# EAGLE design v3pow_2_4v7 (EAGLE 7.7.0)
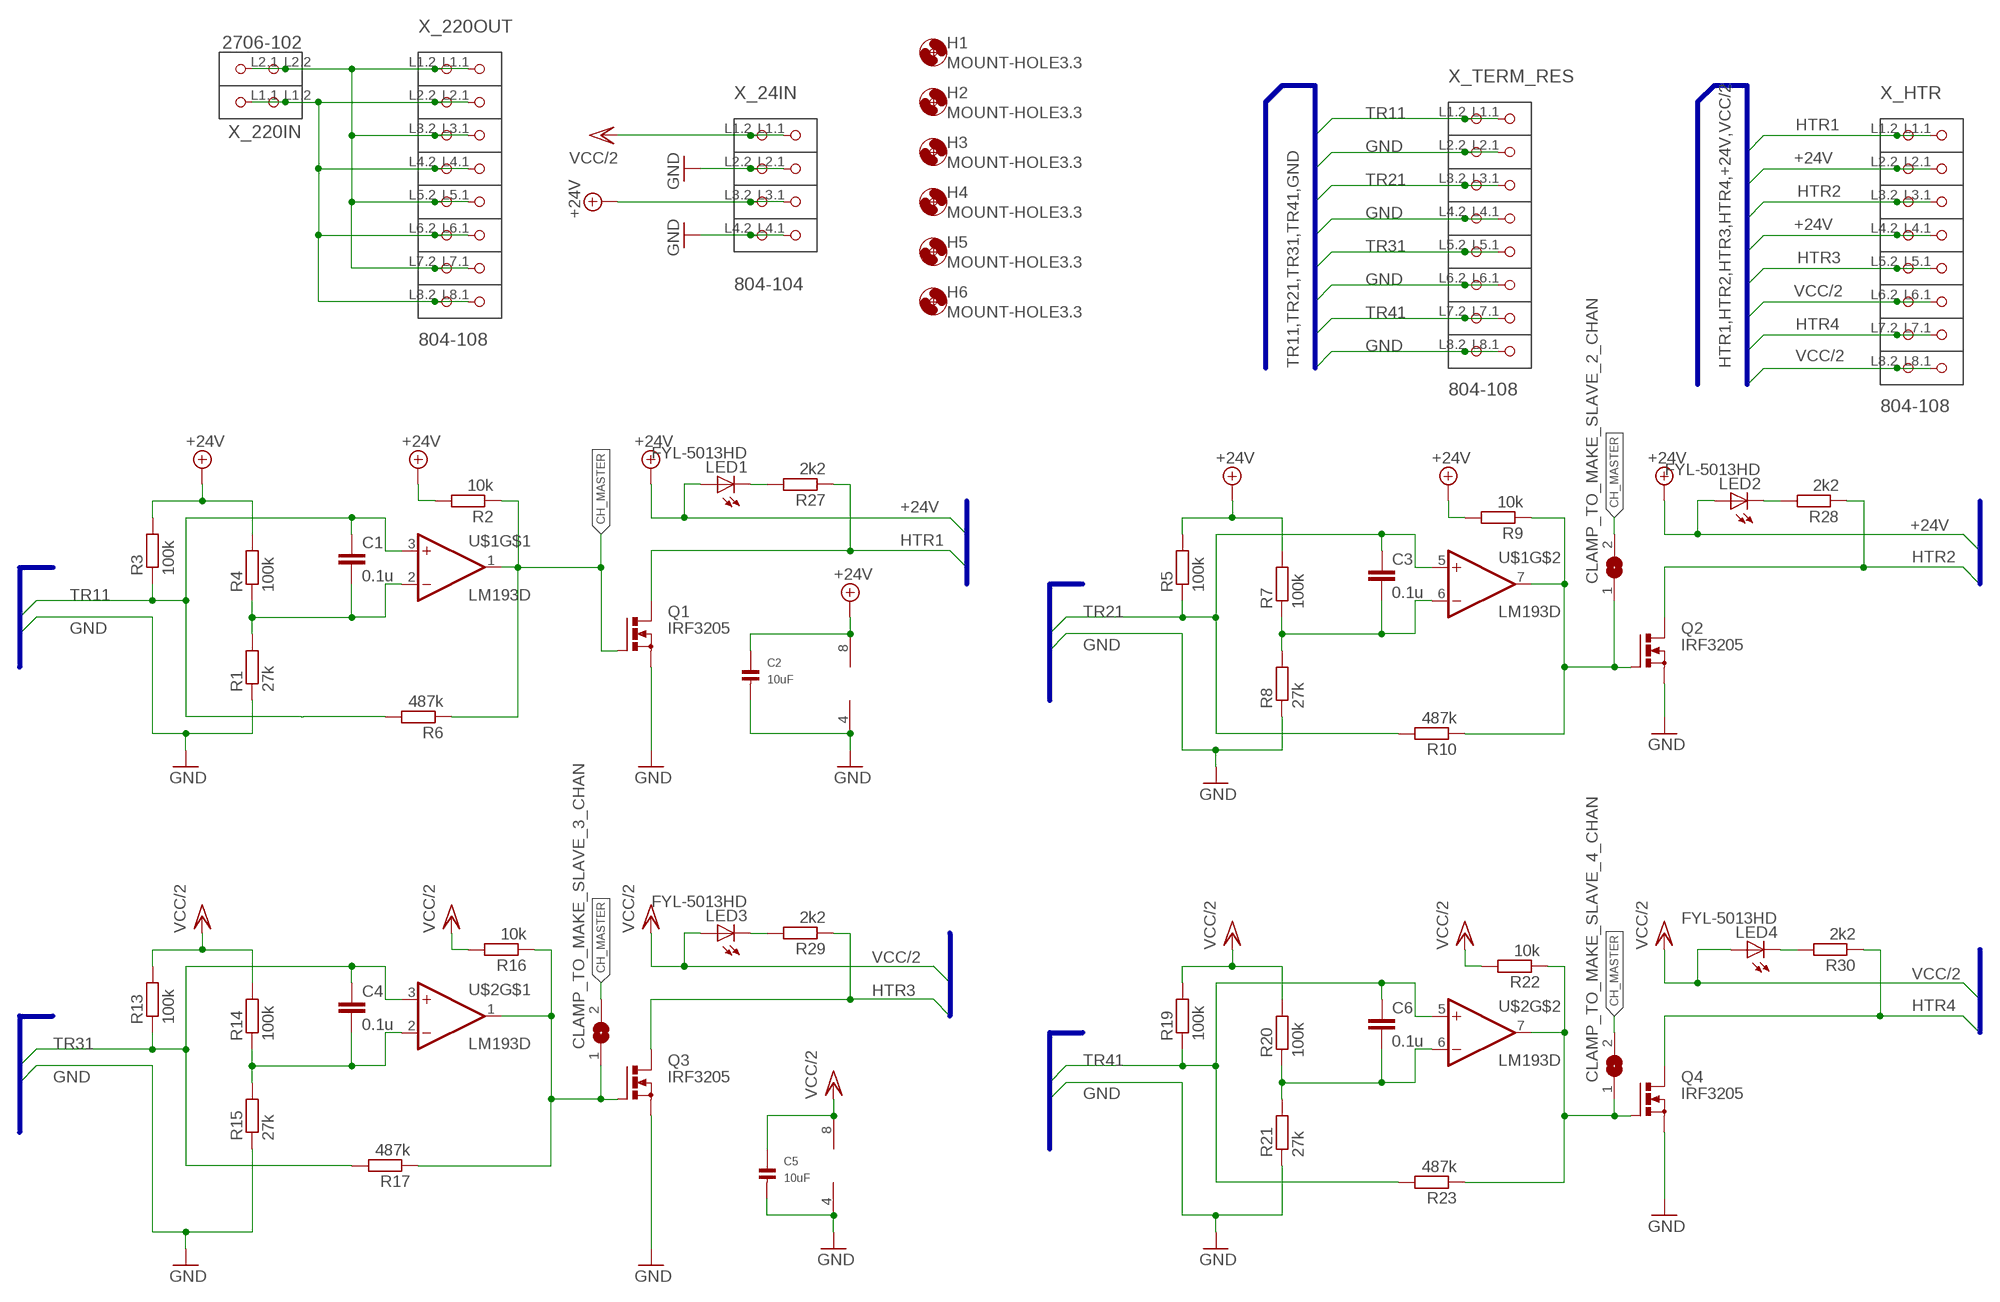
[diagram p0: schematic, sheet 1]

## Parts
C1  0.1u  C-EUC0805  [C0805]
C2  10uF  CAP_CERAMIC1206  [1206]
C3  0.1u  C-EUC0805  [C0805]
C4  0.1u  C-EUC0805  [C0805]
C5  10uF  CAP_CERAMIC1206  [1206]
C6  0.1u  C-EUC0805  [C0805]
CLAMP_TO_MAKE_SLAVE_2_CHAN  SJ  [SJ]
CLAMP_TO_MAKE_SLAVE_3_CHAN  SJ  [SJ]
CLAMP_TO_MAKE_SLAVE_4_CHAN  SJ  [SJ]
H1  MOUNT-HOLE3.3  [3,3]
H2  MOUNT-HOLE3.3  [3,3]
H3  MOUNT-HOLE3.3  [3,3]
H4  MOUNT-HOLE3.3  [3,3]
H5  MOUNT-HOLE3.3  [3,3]
H6  MOUNT-HOLE3.3  [3,3]
LED1  FYL-5013HD  LED5MM  [LED5MM]
LED2  FYL-5013HD  LED5MM  [LED5MM]
LED3  FYL-5013HD  LED5MM  [LED5MM]
LED4  FYL-5013HD  LED5MM  [LED5MM]
Q1  IRF3205  PMOSFET_NTO220BV  [TO220BV]
Q2  IRF3205  PMOSFET_NTO220BV  [TO220BV]
Q3  IRF3205  PMOSFET_NTO220BV  [TO220BV]
Q4  IRF3205  PMOSFET_NTO220BV  [TO220BV]
R1  27k  R-EU_M0805  [M0805]
R2  10k  R-EU_M0805  [M0805]
R3  100k  R-EU_M0805  [M0805]
R4  100k  R-EU_M0805  [M0805]
R5  100k  R-EU_M0805  [M0805]
R6  487k  R-EU_M0805  [M0805]
R7  100k  R-EU_M0805  [M0805]
R8  27k  R-EU_M0805  [M0805]
R9  10k  R-EU_M0805  [M0805]
R10  487k  R-EU_M0805  [M0805]
R13  100k  R-EU_M0805  [M0805]
R14  100k  R-EU_M0805  [M0805]
R15  27k  R-EU_M0805  [M0805]
R16  10k  R-EU_M0805  [M0805]
R17  487k  R-EU_M0805  [M0805]
R19  100k  R-EU_M0805  [M0805]
R20  100k  R-EU_M0805  [M0805]
R21  27k  R-EU_M0805  [M0805]
R22  10k  R-EU_M0805  [M0805]
R23  487k  R-EU_M0805  [M0805]
R27  2k2  R-EU_M0805  [M0805]
R28  2k2  R-EU_M0805  [M0805]
R29  2k2  R-EU_M0805  [M0805]
R30  2k2  R-EU_M0805  [M0805]
U$1  LM193D  [SO08]
U$2  LM193D  [SO08]
X_24IN  804-104  [P-804-104]
X_220IN  2706-102  [P-2706-102]
X_220OUT  804-108  [P-804-108]
X_HTR  804-108  [P-804-108]
X_TERM_RES  804-108  [P-804-108]

## Nets
+24V [24pow]: C2.1 LED1.A LED2.A R2.2 R3.2 R4.2 R5.2 R7.2 R9.2 U$1.8(V+) X_24IN.L3.1(P3.1) X_24IN.L3.2(P3.2) X_HTR.L2.1(P2.1) X_HTR.L2.2(P2.2) X_HTR.L4.1(P4.1) X_HTR.L4.2(P4.2)
CH_MASTER: CLAMP_TO_MAKE_SLAVE_2_CHAN.2 CLAMP_TO_MAKE_SLAVE_3_CHAN.2 CLAMP_TO_MAKE_SLAVE_4_CHAN.2 Q1.G R2.1 R6.1 U$1.1(OUT)
GND [24pow]: C2.2 C5.2 Q1.S Q2.S Q3.S Q4.S R1.1 R8.1 R15.1 R21.1 U$1.4(V-) U$2.4(V-) X_24IN.L2.1(P2.1) X_24IN.L2.2(P2.2) X_24IN.L4.1(P4.1) X_24IN.L4.2(P4.2) X_TERM_RES.L2.1(P2.1) X_TERM_RES.L2.2(P2.2) X_TERM_RES.L4.1(P4.1) X_TERM_RES.L4.2(P4.2) X_TERM_RES.L6.1(P6.1) X_TERM_RES.L6.2(P6.2) X_TERM_RES.L8.1(P8.1) X_TERM_RES.L8.2(P8.2)
HTR1 [mosfet_pow]: Q1.D R27.1 X_HTR.L1.1(P1.1) X_HTR.L1.2(P1.2)
HTR2 [mosfet_pow]: Q2.D R28.1 X_HTR.L3.1(P3.1) X_HTR.L3.2(P3.2)
HTR3 [mosfet_pow]: Q3.D R29.1 X_HTR.L5.1(P5.1) X_HTR.L5.2(P5.2)
HTR4 [mosfet_pow]: Q4.D R30.1 X_HTR.L7.1(P7.1) X_HTR.L7.2(P7.2)
N44 [f220]: X_220IN.L2.1(P2.1) X_220IN.L2.2(P2.2) X_220OUT.L1.1(P1.1) X_220OUT.L1.2(P1.2) X_220OUT.L3.1(P3.1) X_220OUT.L3.2(P3.2) X_220OUT.L5.1(P5.1) X_220OUT.L5.2(P5.2) X_220OUT.L7.1(P7.1) X_220OUT.L7.2(P7.2)
N$1: CLAMP_TO_MAKE_SLAVE_3_CHAN.1 Q3.G R16.1 R17.1 U$2.1(OUT)
N$2: CLAMP_TO_MAKE_SLAVE_2_CHAN.1 Q2.G R9.1 R10.1 U$1.7(OUT)
N$3: CLAMP_TO_MAKE_SLAVE_4_CHAN.1 Q4.G R22.1 R23.1 U$2.7(OUT)
N$10: C3.2 R7.1 R8.2 U$1.6(-IN)
N$13: C1.2 R1.2 R4.1 U$1.2(-IN)
N$15: C4.2 R14.1 R15.2 U$2.2(-IN)
N$20: C6.2 R20.1 R21.2 U$2.6(-IN)
N$28: LED1.K(C) R27.2
N$31: LED2.K(C) R28.2
N$34: LED3.K(C) R29.2
N$36: LED4.K(C) R30.2
NN55 [f220]: X_220IN.L1.1(P1.1) X_220IN.L1.2(P1.2) X_220OUT.L2.1(P2.1) X_220OUT.L2.2(P2.2) X_220OUT.L4.1(P4.1) X_220OUT.L4.2(P4.2) X_220OUT.L6.1(P6.1) X_220OUT.L6.2(P6.2) X_220OUT.L8.1(P8.1) X_220OUT.L8.2(P8.2)
TR11: C1.1 R3.1 R6.2 U$1.3(+IN) X_TERM_RES.L1.1(P1.1) X_TERM_RES.L1.2(P1.2)
TR21: C3.1 R5.1 R10.2 U$1.5(+IN) X_TERM_RES.L3.1(P3.1) X_TERM_RES.L3.2(P3.2)
TR31: C4.1 R13.1 R17.2 U$2.3(+IN) X_TERM_RES.L5.1(P5.1) X_TERM_RES.L5.2(P5.2)
TR41: C6.1 R19.1 R23.2 U$2.5(+IN) X_TERM_RES.L7.1(P7.1) X_TERM_RES.L7.2(P7.2)
VCC/2: C5.1 LED3.A LED4.A R13.2 R14.2 R16.2 R19.2 R20.2 R22.2 U$2.8(V+) X_24IN.L1.1(P1.1) X_24IN.L1.2(P1.2) X_HTR.L6.1(P6.1) X_HTR.L6.2(P6.2) X_HTR.L8.1(P8.1) X_HTR.L8.2(P8.2)

## Buses
TR11,TR12,TR21,TR22,TR31,TR32,TR41,TR42,GND
HTR1,HTR2,HTR3,HTR4,+24V,VCC/2
TR11,TR21,TR31,TR41,GND

## Library data of the parts
C1 C3 C4 C6 = rcl:C-EU: CAPACITOR, European symbol
C2 C5 = microbuilder:CAP_CERAMIC: Ceramic Capacitors 0402 - 0402 Surface Mount Capacitors 16pF 50V 5% [Digikey: 445-4899-2-ND] 18pF 50V 5% [Digikey: 490-1281-2-ND] 22pF 50V 5% [Digikey: 490-1283-2-ND] 68pF 50V 5% [Digikey: 490-1289-2-ND] 0.1uF 10V 10% [Digikey: 490-1318-2-ND] 1.0uF 6.3V 10% [Digikey: 490-1320-2-ND] 0603 - 0603 Surface Mount Capacitors 16 pF 50V 5% [Digikey: 445-5051-2-ND] 22 pF 50V [Digikey: PCC220ACVTR-ND] 33 pF 50V 5% [Digikey: 490-1415-1-ND] 56pF 50V 5% [Digikey: 490-1421-1-ND] 220pF 50V 5% [Digikey: 445-1285-1-ND] 680 pF 50V 2200 pF 50V 5% C0G [Digikey: 445-1297-1-ND] 5600 pF 100V 5% X7R [Digikey: 478-3711-1-ND] 0.1 µF 25V 10% [Digikey: PCC2277TR-ND] 0.22 µF 16V 10% X7R [Digikey: 445-1318-1-ND] 1.0 µF 25V 10% [Digikey: 445-5146-2-ND] 0603 - RF Specific 3pF 250V +/-0.1pF RF [Digikey: 712-1347-1-ND] 18 pF 250V 5% [Digikey: 478-3505-1-ND or 712-1322-1-ND] 56 pF 250V 5% C0G RF [Digikey: 490-4867-1-ND] 68 pF 250V RF [Digikey: 490-4868-1-ND] 0805 - 0805 Surface Mount Capacitors 220 pF 250V 2% RF Ceramic Capacitor [Digikey: 712-1398-1-ND] 1000 pF 50V 2% NP0 Ceramic Capacitor [Digikey: 478-3760-1-ND] 0.1 µF 25V 10% Ceramic Capacitor [Digikey: PCC1828TR-ND] 1.0 µF 16V 10% Ceramic Capacitor[Digikey: 490-1691-2-ND] 10.0 µF 10V 10% Ceramic Capacitor[Digikey: 709-1228-1-ND] 10.0 uF 16V 10% Ceramic Capacitor [Digikey: 478-5165-2-ND] 47 uF 6.3V 20% Ceramic Capacitor [Digikey: 587-1779-1-ND or 399-5506-1-ND] 1206 - 1206 Surface Mount Capacitors 47uF 10V 20% Ceramic Capacitor [Digikey: 490-5528-1-ND or 399-5508-1-ND or 445-6010-1-ND] 100uF 6.3V -20%, +80% Y5V Ceramic Capacitor (Digikey: 490-4512-1-ND, Mouser: 81-GRM31CF50J107ZE1L)
CLAMP_TO_MAKE_SLAVE_2_CHAN CLAMP_TO_MAKE_SLAVE_3_CHAN CLAMP_TO_MAKE_SLAVE_4_CHAN = jumper:SJ: SMD solder JUMPER
H1-H6 = holes:MOUNT-HOLE: MOUNTING HOLE with drill center marker
LED1-LED4 = adafruit:LED: LED OSRAM: - CHIPLED LG R971, LG N971, LY N971, LG Q971, LY Q971, LO R971, LY R971 LH N974, LH R974 LS Q976, LO Q976, LY Q976 LO Q996 - Hyper CHIPLED LW Q18S LB Q993, LB Q99A, LB R99A - SideLED LS A670, LO A670, LY A670, LG A670, LP A670 LB A673, LV A673, LT A673, LW A673 LH A674 LY A675 LS A676, LA A676, LO A676, LY A676, LW A676 LS A679, LY A679, LG A679 - Hyper Micro SIDELED® LS Y876, LA Y876, LO Y876, LY Y876 LT Y87S - SmartLED LW L88C, LW L88S LB L89C, LB L89S, LG L890 LS L89K, LO L89K, LY L89K LS L896, LA L896, LO L896, LY L896 - TOPLED LS T670, LO T670, LY T670, LG T670, LP T670 LSG T670, LSP T670, LSY T670, LOP T670, LYG T670 LG T671, LOG T671, LSG T671 LB T673, LV T673, LT T673, LW T673 LH T674 LS T676, LA T676, LO T676, LY T676, LB T676, LH T676, LSB T676, LW T676 LB T67C, LV T67C, LT T67C, LS T67K, LO T67K, LY T67K, LW E67C LS E67B, LA E67B, LO E67B, LY E67B, LB E67C, LV E67C, LT E67C LW T67C LS T679, LY T679, LG T679 LS T770, LO T770, LY T770, LG T770, LP T770 LB T773, LV T773, LT T773, LW T773 LH T774 LS E675, LA E675, LY E675, LS T675 LS T776, LA T776, LO T776, LY T776, LB T776 LHGB T686 LT T68C, LB T68C - Hyper Mini TOPLED® LB M676 - Mini TOPLED Santana® LG M470 LS M47K, LO M47K, LY M47K Source: http://www.osram.convergy.de/
Q1-Q4 = transistor-power:PMOSFET_N: Power MOSFET N-Channel
R1-R10 R13-R17 R19-R23 R27-R30 = rcl:R-EU_: RESISTOR, European symbol
U$1 U$2 = linear:LM193: lm193 LM193
X_24IN = con-wago_804:804-104: Serie 804, 1-Leiter-Klemmenleiste für Leiterplatten 2 Lötstifte/Pol versetzt / Series 804, 1-conductor PCB terminal strip 2 solder pins/pole, staggered Polzahl / Pole No.: 4 Rastermaß / Pitch: 5 - 5 mm Bemessungsspannung / Rated Voltage: 320 V Nennstrom / Nominal Current: 24 A Leiterquerschnitt / Conductor Size: 0.25 - 2.5 mm2 Anschlusstechnik / Connection Technology: CAGE CLAMP® S Lötstiftlänge: / Solder Pin Length: 3.6 mm Leitereinführung (zur Platine) / Conductor entry angle (to PCB): 0 ° Farbe / Color: grau / gray Stand: 01.01.2014. Die jeweils aktuellen Daten zu diesem Artikel finden Sie in unserem Produktkatalog, den Sie unter www.wago.com einsehen können. As of: 01/01/2014. Please find the newest data for this article in our product catalogue, which can be viewed under www.wago.com.
X_220IN = con-wago_2706:2706-102: Serie 2706, Klemmenleisten mit Betätigungshebeln 2 Lötstifte/Pol / Series 2706, Terminal strips with operating levers 2 solder pins/pole Polzahl / Pole No.: 2 Rastermaß / Pitch: 7.5 mm Bemessungsspannung / Rated Voltage: 630 V Nennstrom / Nominal Current: 41 A Leiterquerschnitt / Conductor Size: 0.5 - 6 mm2 Anschlusstechnik / Connection Technology: CAGE CLAMP® Lötstiftlänge: / Solder Pin Length: 4.5 mm Leitereinführung (zur Platine) / Conductor entry angle (to PCB): 30 ° Farbe / Color: grau / gray Stand: 01.01.2014. Die jeweils aktuellen Daten zu diesem Artikel finden Sie in unserem Produktkatalog, den Sie unter www.wago.com einsehen können. As of: 01/01/2014. Please find the newest data for this article in our product catalogue, which can be viewed under www.wago.com.
X_220OUT X_HTR X_TERM_RES = con-wago_804:804-108: Serie 804, 1-Leiter-Klemmenleiste für Leiterplatten 2 Lötstifte/Pol versetzt / Series 804, 1-conductor PCB terminal strip 2 solder pins/pole, staggered Polzahl / Pole No.: 8 Rastermaß / Pitch: 5 - 5 mm Bemessungsspannung / Rated Voltage: 320 V Nennstrom / Nominal Current: 24 A Leiterquerschnitt / Conductor Size: 0.25 - 2.5 mm2 Anschlusstechnik / Connection Technology: CAGE CLAMP® S Lötstiftlänge: / Solder Pin Length: 3.6 mm Leitereinführung (zur Platine) / Conductor entry angle (to PCB): 0 ° Farbe / Color: grau / gray Stand: 01.01.2014. Die jeweils aktuellen Daten zu diesem Artikel finden Sie in unserem Produktkatalog, den Sie unter www.wago.com einsehen können. As of: 01/01/2014. Please find the newest data for this article in our product catalogue, which can be viewed under www.wago.com.

## Net classes
0 default: width 0.508 mm
1 f220: width 1.524 mm, clearance 1.27 mm
2 24pow: width 1.016 mm
3 mosfet_pow: width 1.524 mm

## Board
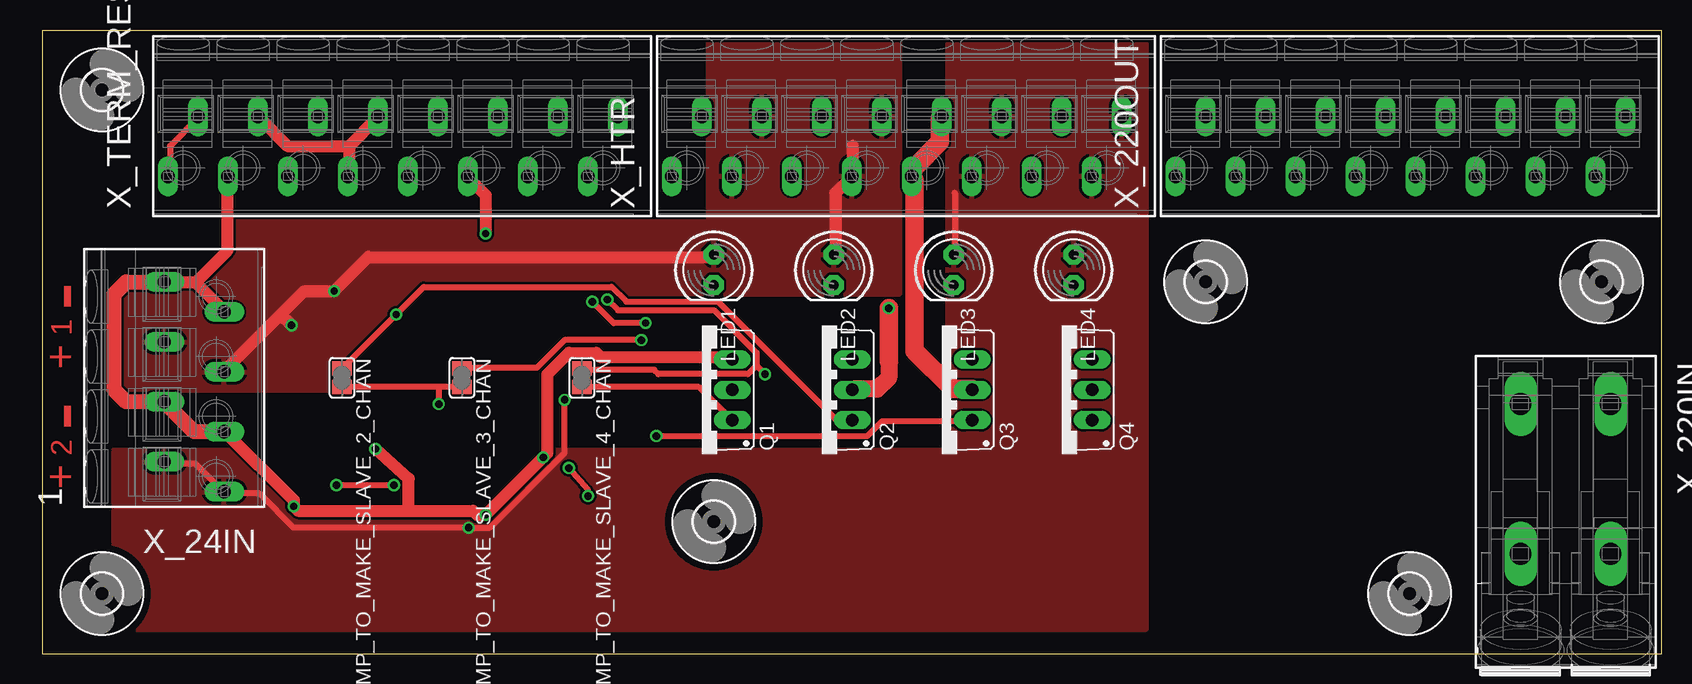
[diagram p1: board, top side]
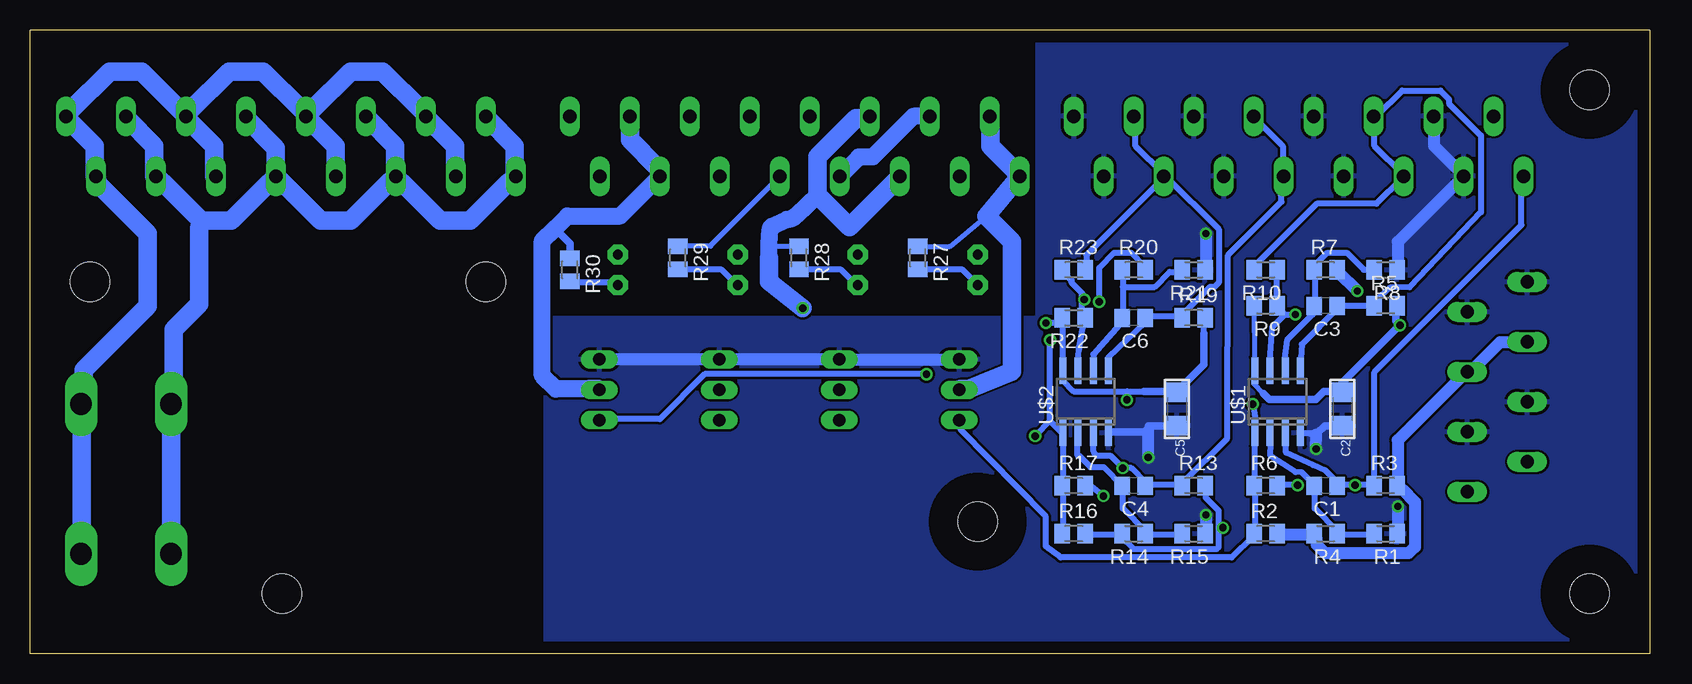
[diagram p2: board, bottom side, seen from below]

Size 135 x 52 mm. Coordinates in mm from the lower left corner, seen from the top.
Outline: 0,0 135,0 135,52 0,52 0,0
Copper layers (1*16): Top 0.035mm / dielectric 1.5mm / Bottom 0.035mm
Design rules "default": minimum track width 10mil, minimum drill 24mil, track to track 8mil, track to pad 8mil, pad to pad 8mil, via to via 8mil, smd to smd 8mil, copper to edge 40mil, drill to drill 8mil, minimum pad ring 10mil, minimum via ring 8mil, stop-mask expansion 4mil, vias tented up to drill 0mil, thermal gap 10mil
tRestrict: area 92.5,-4 to 138,57

### Footprints (pad centres in the part's own frame; a part is rotated, then mirrored left to right if it is on the bottom)
C0805 = smd 1.3 x 1.5: 1 -0.95,0; 2 0.95,0
1206 = smd 1.6 x 1.8: 1 -1.4,0; 2 1.4,0
SJ = smd 1.168 x 1.6: 1 -0.762,0; 2 0.762,0
3,3 = hole 3.3: 0,0
LED5MM = drill 0.813 pad 1.676 octagon: A -1.27,0; K 1.27,0
TO220BV = drill 1.016 long: D 0,-2.54; G -2.54,-2.54; S 2.54,-2.54
M0805 = smd 1.3 x 1.6: 1 -0.95,0; 2 0.95,0
SO08 = smd 0.6 x 2.2: 1 -1.905,-2.6; 2 -0.635,-2.6; 3 0.635,-2.6; 4 1.905,-2.6; 5 1.905,2.6; 6 0.635,2.6; 7 -0.635,2.6; 8 -1.905,2.6
P-804-104 = drill 1.1 long: L1.1 0.8,7; L1.2 -4.2,9.5; L2.1 0.8,2; L2.2 -4.2,4.5; L3.1 0.8,-3; L3.2 -4.2,-0.5; L4.1 0.8,-8; L4.2 -4.2,-5.5
P-2706-102 = drill 1.8 long: L1.1 3.185,3.75; L1.2 -9.315,3.75; L2.1 3.185,-3.75; L2.2 -9.315,-3.75
P-804-108 = drill 1.1 long: L1.1 0.8,17; L1.2 -4.2,19.5; L2.1 0.8,12; L2.2 -4.2,14.5; L3.1 0.8,7; L3.2 -4.2,9.5; L4.1 0.8,2; L4.2 -4.2,4.5; L5.1 0.8,-3; L5.2 -4.2,-0.5; L6.1 0.8,-8; L6.2 -4.2,-5.5; L7.1 0.8,-13; L7.2 -4.2,-10.5; L8.1 0.8,-18; L8.2 -4.2,-15.5

### Placement (x,y rotation side)
C1  27,14 180 bottom
C2  25.6,20.4 270 bottom
C3  27,29 180 bottom
C4  43,14 180 bottom
C5  39.4,20.4 270 bottom
C6  43,28 180 bottom
CLAMP_TO_MAKE_SLAVE_2_CHAN  25,23 270 top
CLAMP_TO_MAKE_SLAVE_3_CHAN  35,23 270 top
CLAMP_TO_MAKE_SLAVE_4_CHAN  45,23 270 top
H1  5,47 0 top
H2  5,5 0 top
H3  114,5 0 top
H4  56,11 0 top
H5  130,31 0 top
H6  97,31 0 top
LED1  56,32 270 top
LED2  66,32 270 top
LED3  76,32 270 top
LED4  86,32 270 top
Q1  55,22 90 top
Q2  65,22 90 top
Q3  75,22 90 top
Q4  85,22 90 top
R1  22,10 180 bottom
R2  32,10 0 bottom
R3  22,14 0 bottom
R4  27,10 180 bottom
R5  22,29 0 bottom
R6  32,14 0 bottom
R7  27,32 0 bottom
R8  22,32 180 bottom
R9  32,29 180 bottom
R10  32,32 180 bottom
R13  38,14 0 bottom
R14  43,10 180 bottom
R15  38,10 180 bottom
R16  48,10 0 bottom
R17  48,14 0 bottom
R19  38,28 0 bottom
R20  43,32 0 bottom
R21  38,32 180 bottom
R22  48,28 180 bottom
R23  48,32 0 bottom
R27  61,33 270 bottom
R28  70.9,33 270 bottom
R29  81,33 270 bottom
R30  90,32 270 bottom
U$1  31,21 0 bottom
U$2  47,21 0 bottom
X_24IN  11,23 180 top
X_220IN  127,11.5 270 top
X_220OUT  114,44 90 top
X_HTR  72,44 90 top
X_TERM_RES  30,44 90 top

### Tracks (layer width: path | path; a pad name or v marks a point on that pad's centre or on a via)
+24V  (via drill 0.61)
  Top 1.016: 67.56,42.32 67.56,39.83 X_HTR.L4.2 67.21,39.47 66.14,38.41 66.14,33.43 LED2.A | 19.91,28.27 15.29,23.65 X_24IN.L3.2 | 19.91,28.27 21.87,30.23 v24.36,30.23 27.2,33.07 55.65,33.07 LED1.A | 19.91,28.27 v20.8,27.38
  Bottom 0.406: 32.18,21.69 33,22.51 33,23 32.91,23.09 U$1.8 32.9,26.8 32.95,26.85 R9.2
  Bottom 0.61: 26.14,21.87 27.13,21.87 27.8,21.2 31.69,21.2 32.18,21.69 | C2.1 25.6,22.58 v20.8,27.38 21.16,27.74 21.16,28.98
  Bottom 1.016: 21.16,28.98 R5.2 | 32.89,28.98 R9.2 | R2.2 30.94,9.96 28.09,9.96 R4.2 27.74,9.6 27.74,9.07 27.03,8.36 20.09,8.36 19.56,8.89 19.56,12.62 20.62,13.69 R3.2 20.98,14.05 20.98,17.78 15.29,23.47 X_24IN.L3.2 14.76,23.65 12.45,25.96 10.31,25.96 X_24IN.L3.1 | v24.36,30.23 25.96,31.83 R7.2 | 26.14,21.87 25.78,21.87 C2.1
  Bottom 1.422: X_HTR.L2.1 61.37,44.8 64.77,41.4 65.9,41.4 X_HTR.L4.2
  pour Top: 6,36 6,22 53,22 53,30 71.5,30 71.5,51 55.5,51 55.5,36
CH_MASTER  (via drill 0.61)
  Top 0.508: CLAMP_TO_MAKE_SLAVE_4_CHAN.2 45.16,22.23 54.76,22.23 57.43,19.56 Q1.G | 33.07,22.23 34.85,22.23 CLAMP_TO_MAKE_SLAVE_3_CHAN.2 | 33.07,22.23 25.07,22.23 CLAMP_TO_MAKE_SLAVE_2_CHAN.2 | 33.07,22.23 v33.07,20.8
  Bottom 0.508: v33.07,20.8 32.87,19.49 U$1.1 32.89,18.31 32.89,14.22 R6.1 32.89,13.87 32.89,10.13 R2.1 33.07,9.78 34.85,8 49.07,8 50.32,8.94 50.32,11.43 57.43,18.67 57.43,19.38 Q1.G
GND  (via drill 0.61)
  Top 1.016: 25.6,42.32 25.6,39.83 X_TERM_RES.L4.2 | 25.6,42.32 27.91,44.63 X_TERM_RES.L4.1 | 25.6,42.32 20.45,42.32 18.14,44.63 X_TERM_RES.L2.1 | v36.98,35.03 36.98,38.23 35.56,39.65 X_TERM_RES.L6.2 | 12.8,30.94 10.31,30.94 X_24IN.L4.1 | 12.8,30.94 15.11,28.63 X_24IN.L4.2 | X_24IN.L2.2 15.29,18.49 20.98,12.8 v20.98,12.27 21.34,11.91 30.58,11.91 | 30.58,11.91 35.92,11.91 36.27,11.56 v36.98,11.56 v41.78,16.36 42.14,16.71 42.14,23.29 43.92,25.07 46.23,25.07 46.58,24.71 57.43,24.71 Q1.S | v27.79,17.07 30.58,14.58 30.58,11.91 | 12.8,30.94 15.47,33.6 15.47,39.65 X_TERM_RES.L2.2
  Top 1.27: X_24IN.L2.2 12.7,18.5 X_24IN.L2.1 7,21 6,22 6,30 7,31 X_24IN.L4.1
  Bottom 0.406: 27.68,18.39 28.09,18.4 U$1.4 29.05,18.36 27.78,18.26 | U$2.4 44.99,18.5
  Bottom 0.61: C5.2 41.78,19 | C2.2 27.07,19 27.68,18.39 | 44.99,18.5 41.83,18.5 41.78,18.54
  Bottom 1.016: R8.1 20.98,32 20.98,34.31 15.65,39.65 X_TERM_RES.L2.2 15.82,40.18 17.96,42.32 17.96,44.63 X_TERM_RES.L2.1 | v36.98,35.03 36.98,32 R21.1 | Q1.S 57.61,24.54 67.39,24.54 Q2.S 67.92,24.54 77.52,24.54 Q3.S 78.05,24.54 87.48,24.54 Q4.S | v20.98,12.27 20.98,10.13 R1.1 | v36.98,11.56 36.98,10.13 R15.1 | v27.79,17.07 27.78,18.26 | v41.78,16.36 41.78,18.54
  pour Bottom: 1,51 1,1 92,1 92,28 51,28 51,51
HTR1
  Bottom 0.406: R27.1 58.33,33.95 55.28,36.49
  Bottom 1.524: Q1.D 57.43,22.05 56.72,22.05 53.15,23.51 53.15,34.36 55.28,36.49 52.63,39.65 X_HTR.L1.2 52.98,40.36 54.94,42.32 54.94,44.63 X_HTR.L1.1
HTR2  (via drill 0.61)
  Top 1.422: 70.59,24.36 70.59,23.01 69.62,22.05 67.59,22.05 Q2.D
  Top 1.524: v70.59,28.8 70.59,24.36
  Bottom 0.406: R28.1 72.85,33.95 73.4,34.2
  Bottom 1.422: 73.4,32.97 73.4,34.2 73.3,35.33 arc45 73.18,35.62 71.9,36.2 arc-45 71.16,36.51 69.34,38.23
  Bottom 1.524: X_HTR.L3.2 62.59,39.65 66.67,35.56 69.34,38.23 69.34,41.43 66.14,44.63 65.08,44.63 X_HTR.L3.1 | v70.59,28.8 73.4,31.02 73.4,32.97
HTR3
  Top 1.524: Q3.D 77.52,22.05 75.92,22.05 72.72,25.25 72.72,39.47 72.54,39.65 X_HTR.L5.2 72.72,40.54 74.85,42.67 74.85,44.63 X_HTR.L5.1
  Bottom 0.406: R29.1 78.23,33.96 78.23,34.07 X_HTR.L5.2
  Bottom 1.524: 72.54,39.65 X_HTR.L5.2
HTR4
  Bottom 0.61: R30.1 90,34.2 91.25,35.45
  Bottom 1.422: 88.37,22.05 91.15,22.05 92.3,23.2 92.3,34.4 91.25,35.45 90.2,36.5 85.8,36.5 X_HTR.L7.2
  Bottom 1.524: X_HTR.L7.1 84.99,44.63 84.99,42.85 82.68,40.54 X_HTR.L7.2 | 88.37,22.05 87.66,22.05 Q4.D
N44
  Bottom 1.524: X_220OUT.L1.1 96.9,44.63 94.59,42.32 94.59,39.83 X_220OUT.L1.2 95.12,39.29 98.32,36.09 100.81,36.09 104.01,39.29 X_220OUT.L3.2 | X_220OUT.L3.2 104.55,39.83 104.55,42.32 106.86,44.63 X_220OUT.L3.1 | X_220IN.L2.1 123.22,8.36 123.22,20.8 X_220IN.L2.2 123.04,21.51 123.04,27.03 120.9,29.16 120.9,35.38 120.73,36.09 | X_220OUT.L5.2 114.5,39.83 114.5,42.14 116.99,44.63 X_220OUT.L5.1 | X_220OUT.L7.1 126.95,44.63 124.64,42.32 124.64,39.83 X_220OUT.L7.2 123.93,39.29 120.73,36.09 | 120.73,36.09 118.24,36.09 115.04,39.29 X_220OUT.L5.2 | X_220OUT.L3.2 105.08,39.29 108.28,36.09 110.77,36.09 113.97,39.29 X_220OUT.L5.2
N$1  (via drill 0.61)
  Top 0.508: v49.96,26.14 43.56,26.14 41.25,23.82 35.03,23.82 CLAMP_TO_MAKE_SLAVE_3_CHAN.1 | v51.21,18.14 68.81,18.14 70.05,19.38 77.52,19.38 Q3.G
  Bottom 0.508: R16.1 48.9,10.13 48.9,13.87 R17.1 48.9,14.22 48.9,18.31 U$2.1 49.07,18.49 49.96,19.38 | 49.96,19.38 v49.96,26.14 | 49.96,19.38 v51.21,18.14
N$2  (via drill 0.61)
  Top 0.508: CLAMP_TO_MAKE_SLAVE_2_CHAN.1 25.07,23.82 v29.52,28.27 31.83,30.58 47.47,30.58 48.72,29.34 56.36,29.34 66.14,19.56 67.39,19.56 Q2.G
  Bottom 0.508: R10.1 31.11,31.83 31.11,29.16 R9.1 30.94,28.8 30.4,28.27 | 30.4,28.27 v29.52,28.27 | 30.4,28.27 31.47,27.2 31.67,24.45 U$1.7
N$3  (via drill 0.61)
  Top 0.508: 59.56,24 58.85,23.29 51.38,23.29 51.03,23.65 45.16,23.65 CLAMP_TO_MAKE_SLAVE_4_CHAN.1 | 59.56,24 59.56,25.07 56.01,28.63 48.01,28.63 v47.12,29.52 | 59.56,24 v60.27,23.29
  Bottom 0.508: U$2.7 47.67,23.95 47.62,24.84 47.55,25.38 47.12,27.91 R22.1 47.3,28.09 47.3,29.52 | 47.3,29.52 47.3,30.05 48.18,30.94 48.18,31.11 48.9,31.83 R23.1 | v47.12,29.52 47.3,29.52 | v60.27,23.29 78.77,23.29 82.5,19.56 87.48,19.56 Q4.G
N$10
  Bottom 0.508: R8.2 23.11,32 23.82,32 25.25,33.43 26.85,33.43 28.09,32.18 R7.1 27.91,31.83 27.91,29.16 C3.2 28.09,28.8 28.09,28.27 30.23,26.14 30.43,24.55 U$1.6
N$13
  Bottom 0.508: R1.2 23.11,9.96 25.78,9.96 R4.1 25.96,10.13 27.91,12.09 27.91,13.87 C1.2 28.09,14.22 28.98,15.11 29.52,15.14 31.6,16.46 31.57,17.51 U$1.2
N$15
  Bottom 0.508: C4.2 43.92,13.87 43.92,12.09 41.96,10.13 R14.1 41.78,9.96 39.12,9.96 R15.2 | U$2.2 47.67,17.61 47.68,16.51 47.57,16.51 46.61,15.54 45.49,15.54 C4.2 | 44.09,14.22 C4.2
N$20
  Bottom 0.508: 43.92,30.58 43.92,31.83 R20.1 | 43.92,30.58 43.92,28.09 C6.2 43.92,27.74 46.35,24.94 46.35,23.72 U$2.6 | 43.92,30.58 41.25,30.58 40.01,31.83 39.12,31.83 R21.2
N$28
  Bottom 0.508: R27.2 60.98,32 57.25,32 56.01,30.76 LED1.K
N$31
  Bottom 0.508: R28.2 70.94,32 67.39,32 66.14,30.76 LED2.K
N$34
  Bottom 0.508: R29.2 80.9,32 77.34,32 76.1,30.76 LED3.K
N$36
  Bottom 0.508: R30.2 89.97,30.94 86.23,30.94 86.06,30.76 LED4.K
NN55
  Bottom 1.524: X_220OUT.L2.2 99.57,39.83 99.57,42.32 101.88,44.63 X_220OUT.L2.1 102.41,45.34 105.61,48.54 108.28,48.54 111.48,45.34 X_220OUT.L4.1 | X_220OUT.L4.2 109.53,39.83 109.53,42.32 111.84,44.63 X_220OUT.L4.1 | X_220IN.L1.1 130.68,8.36 130.68,20.8 X_220IN.L1.2 130.5,21.51 130.5,23.65 125.17,28.98 125.17,35.03 129.26,39.12 X_220OUT.L8.2 129.62,39.83 129.62,42.32 131.93,44.63 X_220OUT.L8.1 131.57,45.34 128.37,48.54 125.7,48.54 122.5,45.34 X_220OUT.L6.1 | X_220OUT.L6.2 119.66,39.83 119.66,42.32 121.97,44.63 X_220OUT.L6.1 | X_220OUT.L4.1 112.37,45.34 115.57,48.54 118.42,48.54 121.61,45.34 X_220OUT.L6.1
TR11  (via drill 0.61)
  Top 0.508: X_TERM_RES.L1.2 10.67,39.83 10.67,42.32 12.98,44.63 X_TERM_RES.L1.1 | v24.54,14.05 v29.34,14.05
  Bottom 0.508: v29.34,14.05 30.94,14.05 R6.2 | U$1.3 30.33,17.51 30.3,16.76 28.04,15.72 27.03,15.29 25.96,14.22 C1.1 25.96,14.05 v24.54,14.05 23.11,14.05 R3.1 22.94,14.22 22.94,23.47 10.67,35.74 10.67,39.65 X_TERM_RES.L1.2
TR21
  Bottom 0.508: U$1.5 29.08,24.65 28.98,25.78 25.96,28.8 C3.1 25.96,28.98 23.11,28.98 R5.1 22.76,29.16 22.76,29.52 21.67,30.5 19.99,30.56 14.05,36.8 14.05,43.2 16.71,45.87 16.71,46.23 17.42,46.94 20.62,46.94 22.76,44.81 X_TERM_RES.L3.1 22.94,44.63 22.94,42.32 20.62,40.01 X_TERM_RES.L3.2 20.62,39.65 22.76,37.52 27.74,37.52 32.89,32.36 32.89,32 R10.2
TR31  (via drill 0.6, 0.61)
  Top 0.508: v45.52,13.13 45.52,13.66 v43.92,15.47
  Bottom 0.508: X_TERM_RES.L5.1 32.89,44.63 30.58,42.32 30.58,39.83 X_TERM_RES.L5.2 30.76,39.65 30.68,37.67 35.13,33.22 35.2,17.96 38.94,14.22 R13.1 39.12,14.05 41.96,14.05 C4.1 41.96,14.22 43.2,15.47 v43.92,15.47 44.96,16.51 46.1,16.51 46.28,16.69 46.35,16.85 U$2.3 | R17.2 46.56,14 v45.52,13.13
TR41
  Bottom 0.508: U$2.5 45.11,24.65 45.09,24.71 42.04,27.64 C6.1 41.96,28.09 39.12,28.09 R19.1 38.94,28.27 36.63,30.58 36.27,30.58 35.92,30.94 35.92,35.38 40.36,39.83 X_TERM_RES.L7.2 | R23.2 46.94,32 46.94,33.25 40.54,39.65 X_TERM_RES.L7.2 | X_TERM_RES.L7.1 42.85,44.63 42.85,42.32 40.54,40.01 X_TERM_RES.L7.2
VCC/2  (via drill 0.61)
  Top 0.508: 76.1,38.41 76.1,33.43 LED3.A | X_24IN.L1.1 10.31,15.82 12.8,15.82 15.11,13.51 X_24IN.L1.2 15.29,13.34 18.14,13.34 20.98,10.49 v35.56,10.49 37.34,10.49 43.56,16.71 v43.56,21.16 | v45.87,29.34 47.65,27.56 v50.32,27.56
  Bottom 0.508: 43.56,21.87 48.01,21.87 48.9,22.76 48.9,23.47 U$2.8 48.9,23.82 48.9,27.91 R22.2 49.07,27.56 v50.32,27.56 | 43.56,21.87 42.14,21.87 | 37.16,26.67 37.16,27.91 R19.2 | R16.2 46.94,9.96 44.09,9.96 R14.2 44.09,9.78 43.03,8.71 36.09,8.71 35.92,8.89 35.92,10.49 | 35.92,10.49 35.92,11.91 36.98,12.98 36.98,13.87 R13.2 | v35.56,10.49 35.92,10.49 | v43.56,21.16 43.56,21.87 | v45.87,29.34 45.87,32.18 44.63,33.43 43.2,33.43 42.14,32.36 42.14,32 R20.2
  Bottom 0.61: 42.14,21.87 39.4,21.87 | 39.4,21.87 C5.1 | 39.4,21.87 37.16,24.11 37.16,26.67
  pour Top: 6,17 75.5,17 75.5,51 92,51 92,2 6,2

### Text on the board
Top: - | 1 | + | - | 2 | +
tValues: 220V1 | 220V2 | 220V3 | 220V4 | TRES2 | TRES3 | TRES4 | _ | TRES1 | 1 | + | 24V1 | _ | 2 | 24V2 | + | HTR_1 | HTR_2 | HTR_3 | HTR_4